# EAGLE design DAPule-STM32F103-v1.0.0 (EAGLE 7.7.0)

## Sheet 1 of 2
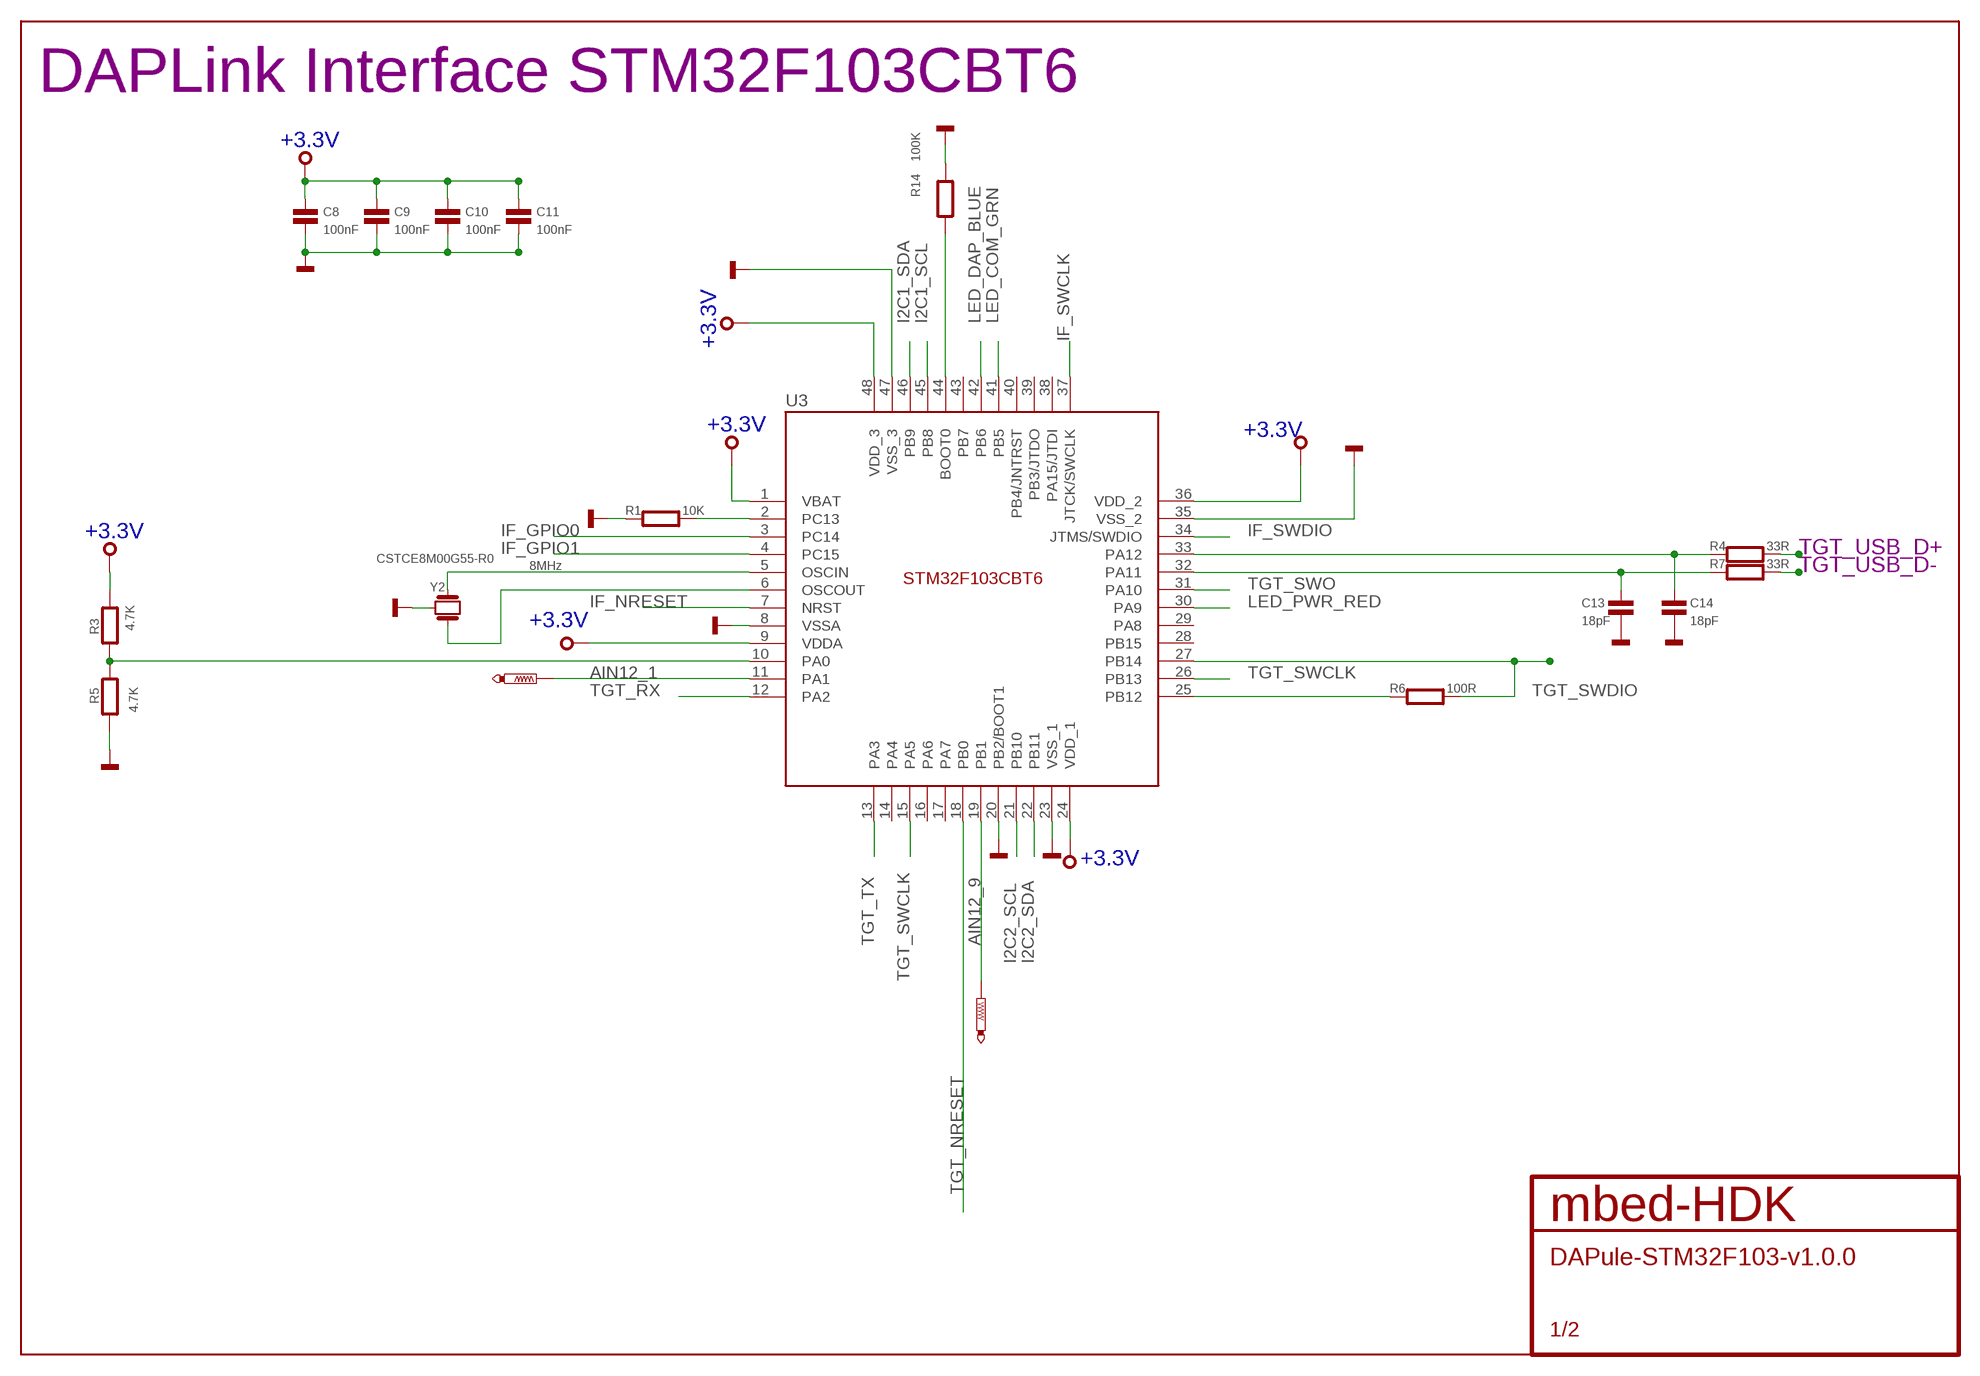
[diagram p0: schematic, sheet 1]

### Parts
C8  100nF  CAPACITOR0603  [0603]
C9  100nF  CAPACITOR0603  [0603]
C10  100nF  CAPACITOR0603  [0603]
C11  100nF  CAPACITOR0603  [0603]
C13  18pF  CAPACITOR0603  [0603]
C14  18pF  CAPACITOR0603  [0603]
R1  10K  RESISTOR0603  [0603]
R3  4.7K  RESISTOR0603  [0603]
R4  33R  RESISTOR0603  [0603]
R5  4.7K  RESISTOR0603  [0603]
R6  100R  RESISTOR0603  [0603]
R7  33R  RESISTOR0603  [0603]
R14  100K  RESISTOR0603  [0603]
TP1  PTR1TP07R  [TP07R]
TP2  PTR1TP07R  [TP07R]
U3  STM32F103CBT6  [LQFP48]
Y2  CSTCE8M00G55-R0  [CSTCE8M00G55-R0]

### Nets
+3.3V: C8.1 C9.1 C10.1 C11.1 R3.1 U3.1(VBAT) U3.9(VDDA) U3.24(VDD_1) U3.36(VDD_2) U3.48(VDD_3) ; also sheet 2
AIN12_1: TP2.TP U3.11(PA1)
AIN12_9: TP1.TP U3.19(PB1)
GND: C8.2 C9.2 C10.2 C11.2 C13.2 C14.2 R1.1 R5.2 R14.1 U3.8(VSSA) U3.20(PB2/BOOT1) U3.23(VSS_1) U3.35(VSS_2) U3.47(VSS_3) Y2.2 ; also sheet 2
I2C1_SCL: U3.45(PB8)
I2C1_SDA: U3.46(PB9)
I2C2_SCL: U3.21(PB10) ; also sheet 2
I2C2_SDA: U3.22(PB11) ; also sheet 2
IF_GPIO0: U3.3(PC14) ; also sheet 2
IF_GPIO1: U3.4(PC15) ; also sheet 2
IF_NRESET: U3.7(NRST) ; also sheet 2
IF_SWCLK: U3.37(JTCK/SWCLK) ; also sheet 2
IF_SWDIO: U3.34(JTMS/SWDIO) ; also sheet 2
LED_COM_GRN: U3.41(PB5) ; also sheet 2
LED_DAP_BLUE: U3.42(PB6) ; also sheet 2
LED_PWR_RED: U3.30(PA9) ; also sheet 2
N$3: R14.2 U3.44(BOOT0)
N$4: R1.2 U3.2(PC13)
N$5: U3.6(OSCOUT) Y2.3
N$6: U3.5(OSCIN) Y2.1
N$8: R3.2 R5.1 U3.10(PA0)
N$12: R6.1 U3.25(PB12)
N$15: C14.1 R4.1 U3.33(PA12)
N$17: C13.1 R7.1 U3.32(PA11)
TGT_NRESET: U3.18(PB0) ; also sheet 2
TGT_RX: U3.12(PA2) ; also sheet 2
TGT_SWCLK: U3.15(PA5) U3.26(PB13) ; also sheet 2
TGT_SWDIO: R6.2 U3.27(PB14) ; also sheet 2
TGT_SWO: U3.31(PA10) ; also sheet 2
TGT_TX: U3.13(PA3) ; also sheet 2
TGT_USB_D+: R4.2 ; also sheet 2
TGT_USB_D-: R7.2 ; also sheet 2
Unconnected: U3.14(PA4) U3.16(PA6) U3.17(PA7) U3.28(PB15) U3.29(PA8) U3.38(PA15/JTDI) U3.39(PB3/JTDO) U3.40(PB4/JNTRST) U3.43(PB7)

### Notes on the sheet
- DAPLink Interface STM32F103CBT6
- 8MHz

## Sheet 2 of 2
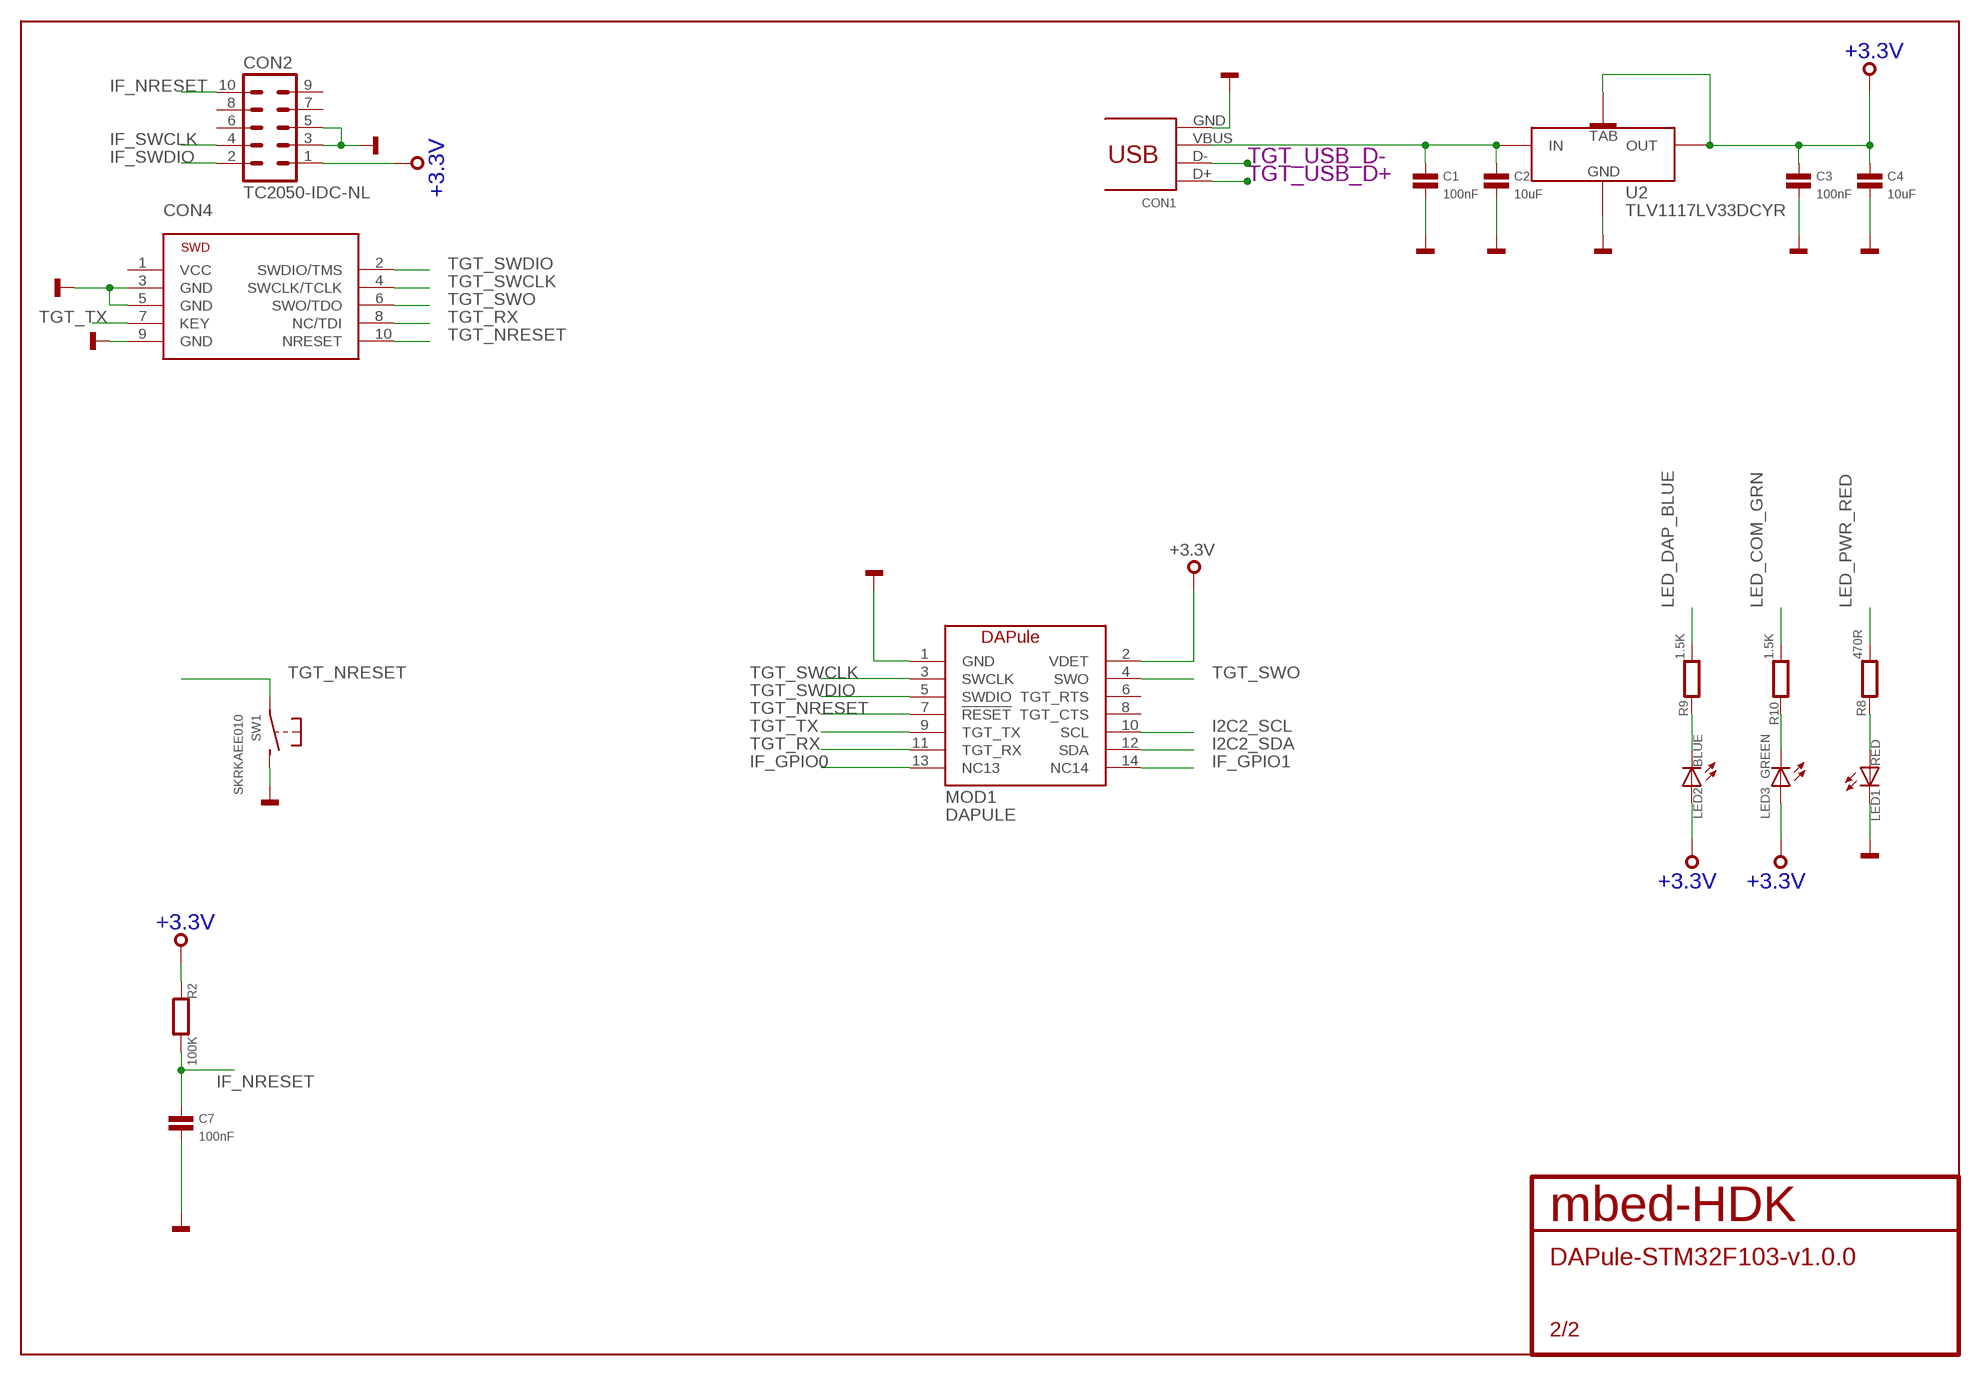
[diagram p1: schematic, sheet 2]

### Parts
C1  100nF  CAPACITOR0603  [0603]
C2  10uF  CAPACITOR0603  [0603]
C3  100nF  CAPACITOR0603  [0603]
C4  10uF  CAPACITOR0603  [0603]
C7  100nF  CAPACITOR0603  [0603]
CON1  47346-0001  [USB-MICRO-B-H]
CON2  TC2050-IDC-NL  [TC2050-IDC-NL]
CON4  SWD-10-SMD  [SWD-10-SMD]
LED1  RED  SMD_LED0603  [CHIPLED_0603]
LED2  BLUE  SMD_LED0603  [CHIPLED_0603]
LED3  GREEN  SMD_LED0603  [CHIPLED_0603]
MOD1  DAPULE  [DAPULE]
R2  100K  RESISTOR0603  [0603]
R8  470R  RESISTOR0603  [0603]
R9  1.5K  RESISTOR0603  [0603]
R10  1.5K  RESISTOR0603  [0603]
SW1  SKRKAEE010  [SKRKAEE010]
U2  TLV1117LV33DCYR  [SOT223]

### Nets
+3.3V: C3.1 C4.1 CON2.1 LED2.A LED3.A MOD1.2(VDET) R2.1 U2.OUT(1)(OUT) U2.OUT(2)(TAB) ; also sheet 1
GND: C1.2 C2.2 C3.2 C4.2 C7.2 CON1.GND CON2.3 CON2.5 CON4.3(GND) CON4.5(GND) CON4.9(GND) LED1.C MOD1.1(GND) SW1.P$2(S) U2.GND ; also sheet 1
I2C2_SCL: MOD1.10(SCL) ; also sheet 1
I2C2_SDA: MOD1.12(SDA) ; also sheet 1
IF_GPIO0: MOD1.13(NC13) ; also sheet 1
IF_GPIO1: MOD1.14(NC14) ; also sheet 1
IF_NRESET: C7.1 CON2.10 R2.2 ; also sheet 1
IF_SWCLK: CON2.4 ; also sheet 1
IF_SWDIO: CON2.2 ; also sheet 1
LED_COM_GRN: R10.2 ; also sheet 1
LED_DAP_BLUE: R9.2 ; also sheet 1
LED_PWR_RED: R8.2 ; also sheet 1
N$1: C1.1 C2.1 CON1.VBUS U2.IN
N$11: LED1.A R8.1
N$13: LED2.C R9.1
N$14: LED3.C R10.1
TGT_NRESET: CON4.10(NRESET) MOD1.7(!RESET) SW1.P$1(P) ; also sheet 1
TGT_RX: CON4.8(NC/TDI) MOD1.11(TGT_RX) ; also sheet 1
TGT_SWCLK: CON4.4(SWCLK/TCLK) MOD1.3(SWCLK) ; also sheet 1
TGT_SWDIO: CON4.2(SWDIO/TMS) MOD1.5(SWDIO) ; also sheet 1
TGT_SWO: CON4.6(SWO/TDO) MOD1.4(SWO) ; also sheet 1
TGT_TX: CON4.7(KEY) MOD1.9(TGT_TX) ; also sheet 1
TGT_USB_D+: CON1.D+ ; also sheet 1
TGT_USB_D-: CON1.D- ; also sheet 1
Unconnected: CON2.6 CON2.7 CON2.8 CON2.9 CON4.1(VCC) MOD1.6(TGT_RTS) MOD1.8(TGT_CTS)

## Library data of the parts
C1 C3 C7-C11 = mbed-HDK-RLCQ:CAPACITOR: Capacitor
C2 C4 C13 C14 = mbed-HDK-RLC:CAPACITOR: Capacitor
CON1 = mbed-HDK-Connector:47346-0001: USB Receptacle Horizontal Micro Type B; MF: MOLEX; MFN: 47346-0001; OC-MOUSER: 538-47346-0001; OC-NEWARK: 1568026
CON2 = mbed-HDK-Connector:TC2050-IDC: Tag-Connect In Circuit Programming & Debug Cable 10 Pin
CON4 = mbed-HDK-Connector:SWD-10: 2.54mm pitch 10-Pin Cortex Programming Header
LED1-LED3 = mbed-HDK-Optical:SMD_LED: LED SMD, Colour Red; MF: Wurth Electronics Inc; MFN: 150060RS75000; OC-DIGIKEY: 732-4978-1-ND; OC-MOUSER: 710-150060RS75000; OC-NEWARK: 2322071
MOD1 = blackbriar:DAPULE
R1 R4 R6 R7 = mbed-HDK-RLC:RESISTOR: Resistor
R2 R3 R5 R8-R10 R14 = mbed-HDK-RLCQ:RESISTOR: Resistor
SW1 = mbed-HDK-Switch:SKRKAEE010: MOMENTARY SWITCH PUSH VERTICAL (SPST); MF: ALPS; MFN: SKRKAEE010; OC-MOUSER: 688-SKRKAE
TP1 TP2 = blackbriar:PTR1: TEST PIN
U2 = mbed-HDK-Power:TLV1117LV33DCYR: LDO Fixed Regulator 3.3v, 1A; MF: Texas Instruments; MFN: TLV1117LV33DCYR; OC-DIGIKEY: 296-28778-1-ND; OC-MOUSER: 595-TLV1117LV33DCYR; OC-NEWARK: 2323647
U3 = mbed-HDK-MF-ST:STM32F103CBT6: ARM® Cortex®-M3 STM32 F1 Microcontroller IC 32-Bit 72MHz 128KB (128K x 8) FLASH; MF: STMicroelectronics; MFN: STM32F103CBT6; OC-DIGIKEY: 497-6288-ND; OC-MOUSER: 511-STM32F103CBT6; OC-NEWARK: 11N8296
Y2 = mbed-HDK-Oscillator:CSTCE8M00G55-R0: Resonator Cermanic, Murata 8MHz 33pF; MF: Murata; MFN: CSTCE8M00G55-R0; OC-DIGIKEY: 490-1195-1-ND; OC-MOUSER: 81-CSTCE8M00G55-R0; OC-NEWARK: 2443270

## Board
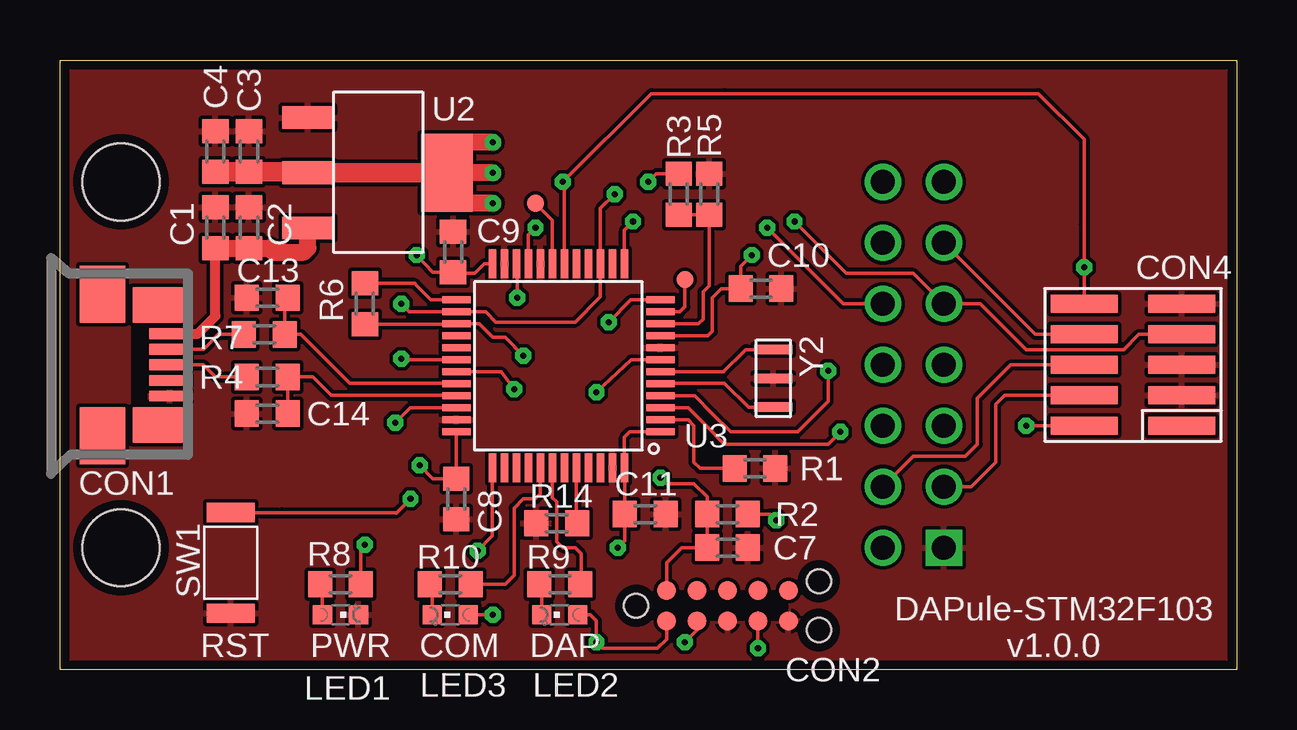
[diagram p2: board, top side]
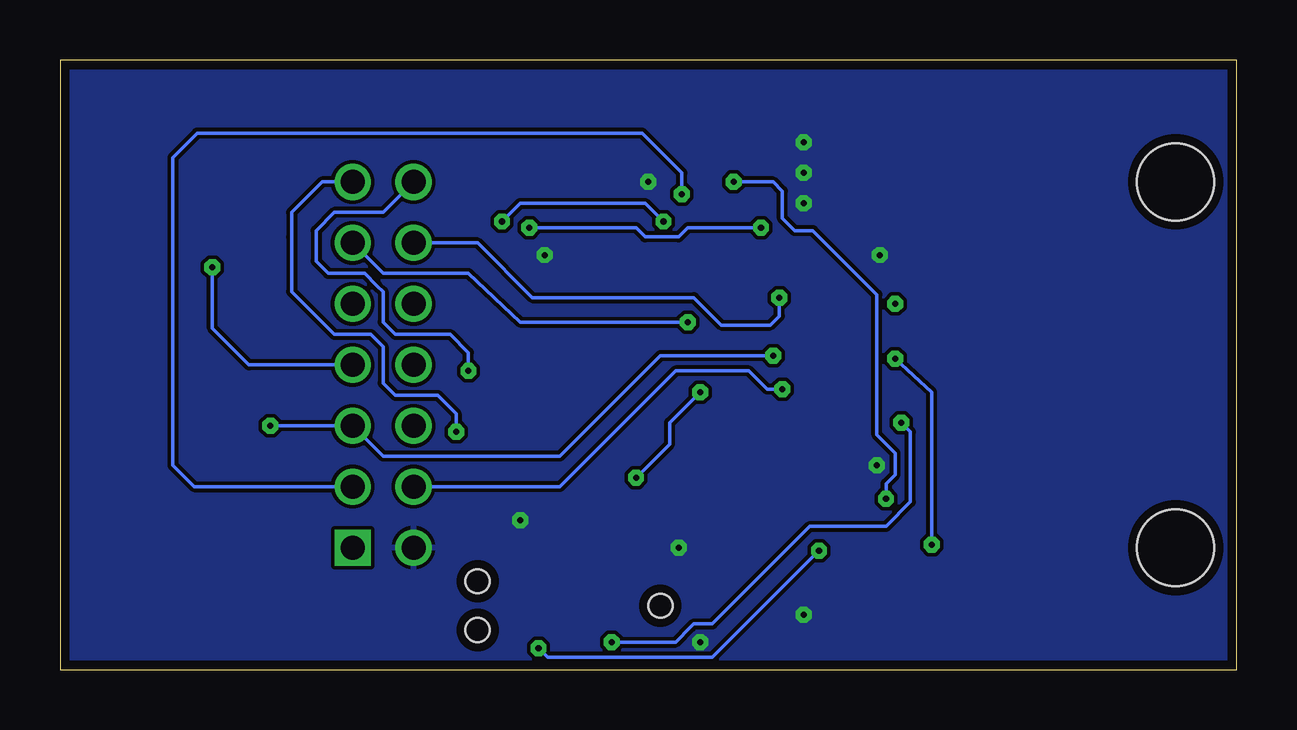
[diagram p3: board, bottom side, seen from below]

Size 49.02 x 25.4 mm. Coordinates in mm from the lower left corner, seen from the top.
Outline: 0,7.62 0,21.59 0,25.4 45.72,25.4 49.02,25.4 49.02,0 45.72,0 0,0 0,3.81 0,7.62
Copper layers ((1*16)): Top 0.035mm / dielectric 0.8mm / Bottom 0.035mm
Design rules "mbed-HDK-6-6-2-layer *": minimum track width 6mil, minimum drill 9mil, track to track 6mil, track to pad 6mil, pad to pad 6mil, via to via 6mil, smd to smd 6mil, copper to edge 15mil, drill to drill 8mil, minimum pad ring 10mil, minimum via ring 8mil, stop-mask expansion 4mil, vias tented up to drill 0mil, thermal gap 6mil

### Footprints (pad centres in the part's own frame; a part is rotated, then mirrored left to right if it is on the bottom)
0603 = smd 1 x 1.1: 1 -0.85,0; 2 0.85,0
USB-MICRO-B-H = smd 1.7 x 0.45: 4 2.8,-0.65; D+ 2.8,0; D- 2.8,0.65; GND 2.8,-1.3; VBUS 2.8,1.3 | smd 1.9 x 2.375: GND1 0,2.95; GND4 0,-2.95 | smd 2.1 x 1.475: GND2 2.3,2.5; GND3 2.3,-2.5
TC2050-IDC-NL = smd 0.787 x 0.787: 1 -2.54,-0.635; 2 -1.27,-0.635; 3 0,-0.635; 4 1.27,-0.635; 5 2.54,-0.635; 6 2.54,0.635; 7 1.27,0.635; 8 0,0.635; 9 -1.27,0.635; 10 -2.54,0.635 | hole 0.991: -3.81,0; 3.81,1.016; 3.81,-1.016
SWD-10-SMD = smd 0.762 x 2.794: 1 0.381,-2.032; 2 0.381,2.032; 3 1.651,-2.032; 4 1.651,2.032; 5 2.921,-2.032; 6 2.921,2.032; 7 4.191,-2.032; 8 4.191,2.032; 9 5.461,-2.032; 10 5.461,2.032
CHIPLED_0603 = smd 0.8 x 0.8: A 0,-0.75; C 0,0.75
DAPULE = drill 1 square: 1 36.83,-7.62 | drill 1: 2 34.29,-7.62; 3 36.83,-5.08; 4 34.29,-5.08; 5 36.83,-2.54; 6 34.29,-2.54; 7 36.83,0; 8 34.29,0; 9 36.83,2.54; 10 34.29,2.54; 11 36.83,5.08; 12 34.29,5.08; 13 36.83,7.62; 14 34.29,7.62 | hole 3.2: 2.54,7.62; 2.54,-7.62
SKRKAEE010 = smd 0.8 x 2: P$1 -2.1,0; P$2 2.1,0
TP07R = smd 0.7 x 0.7: TP 0,0
SOT223 = smd 0.95 x 2.15: GND -2.3,-5.8; IN 2.3,-5.8; OUT(1) 0,-5.8 | smd 3.25 x 2.15: OUT(2) 0,0
LQFP48 = smd 0.3 x 1.2: 1 0,0; 2 0.5,0; 3 1,0; 4 1.5,0; 5 2,0; 6 2.5,0; 7 3,0; 8 3.5,0; 9 4,0; 10 4.5,0; 11 5,0; 12 5.5,0; 25 5.5,8.5; 26 5,8.5; 27 4.5,8.5; 28 4,8.5; 29 3.5,8.5; 30 3,8.5; 31 2.5,8.5; 32 2,8.5; 33 1.5,8.5; 34 1,8.5; 35 0.5,8.5; 36 0,8.5 | smd 1.2 x 0.3: 13 7,1.5; 14 7,2; 15 7,2.5; 16 7,3; 17 7,3.5; 18 7,4; 19 7,4.5; 20 7,5; 21 7,5.5; 22 7,6; 23 7,6.5; 24 7,7; 37 -1.5,7; 38 -1.5,6.5; 39 -1.5,6; 40 -1.5,5.5; 41 -1.5,5; 42 -1.5,4.5; 43 -1.5,4; 44 -1.5,3.5; 45 -1.5,3; 46 -1.5,2.5; 47 -1.5,2; 48 -1.5,1.5
CSTCE8M00G55-R0 = smd 0.4 x 1.6: 1 2.4,0; 2 1.2,0; 3 0,0

### Placement (x,y rotation side)
C1  6.48,18.41 90 top
C2  7.87,18.41 90 top
C3  7.87,21.59 90 top
C4  6.48,21.59 90 top
C7  27.81,5.08 0 top
C8  16.51,7.11 270 top
C9  16.38,17.4 90 top
C10  29.21,15.88 0 top
C11  24.38,6.48 0 top
C13  8.64,15.49 180 top
C14  8.64,10.67 180 top
CON1  1.78,12.7 0 top
CON2  27.81,2.67 0 top
CON4  44.7,9.78 90 top
LED1  11.68,2.29 270 top
LED2  20.83,2.29 90 top
LED3  16.26,2.29 90 top
MOD1  0,12.7 0 top
R1  28.96,8.38 180 top
R2  27.81,6.48 180 top
R3  25.78,19.81 270 top
R4  8.64,12.19 180 top
R5  27.05,19.81 90 top
R6  12.7,15.24 270 top
R7  8.51,13.97 180 top
R8  11.68,3.56 0 top
R9  20.83,3.56 0 top
R10  16.26,3.56 0 top
R14  20.7,6.1 0 top
SW1  7.11,4.44 270 top
TP1  19.81,19.43 0 top
TP2  26.04,16.26 0 top
U2  16.13,20.7 270 top
U3  25.02,9.91 90 top
Y2  29.72,13.33 270 top

### Tracks (layer width: path | path; a pad name or v marks a point on that pad's centre or on a via)
+3.3V  (via drill 0.25)
  Top 0.152: LED3.A v18.03,2.29 | LED2.A 22.1,2.29 22.35,2.03 v22.35,1.14 22.61,0.89 24.89,0.89 25.27,1.27 CON2.1 | R2.1 29.59,6.48 v29.84,6.22 | U3.24 17.67,16.91 17.27,16.51 16.42,16.51 C9.1 15.53,16.55 v14.86,17.27 | R3.1 24.85,20.66 v24.51,20.32 | U3.36 C8.1 15.53,7.96 v14.99,8.51 | U3.1 23.75,9.91 23.52,9.68 U3.48 23.53,8.39 C11.1 23.53,5.37 v23.24,5.08 | U3.9 26.99,13.91 27.18,14.1 27.18,15.49 27.56,15.88 C10.1 28.36,16.8 v28.83,17.27
  Top 0.711: v18.03,20.7 U2.OUT(2) | v18.03,21.97 16.13,21.97 U2.OUT(2) | v18.03,19.43 16.13,19.43 U2.OUT(2)
  Top 0.813: C4.1 C3.1 10.29,20.74 U2.OUT(1) U2.OUT(2)
  pour Bottom: 0,0 49.02,0 49.02,25.4 0,25.4
AIN12_1
  Top 0.152: U3.11 25.83,14.91 26.04,15.11 TP2.TP
AIN12_9
  Top 0.152: U3.19 20.52,18.72 TP1.TP
GND
  pour Top: 0,0 49.02,0 49.02,25.4 0,25.4
I2C2_SCL  (via drill 0.25)
  Top 0.152: U3.21 19.52,18.12 v19.81,18.41 | MOD1.10 32.64,15.24 31.75,16.13 30.61,17.27 v29.46,18.41
  Bottom 0.152: v19.81,18.41 22.86,18.41 23.24,18.03 24.64,18.03 25.02,18.41 v29.46,18.41
I2C2_SDA  (via drill 0.25)
  Top 0.152: v19.05,15.49 19.05,16.88 U3.22
  Bottom 0.152: MOD1.12 31.62,17.78 29.34,15.49 22.61,15.49 21.46,14.35 19.43,14.35 19.05,14.73 v19.05,15.49
IF_GPIO0  (via drill 0.25)
  Top 0.152: U3.3 26.18,10.91 26.92,10.16 27.69,9.4 32,9.4 v32.51,9.91
  Bottom 0.152: MOD1.13 38.1,20.32 39.37,19.05 39.37,18.03 39.37,15.75 37.59,13.97 36.07,13.97 35.56,13.46 35.56,11.94 35.05,11.43 33.27,11.43 32.51,10.67 v32.51,9.91
IF_GPIO1  (via drill 0.25)
  Top 0.152: U3.4 26.44,11.41 27.18,10.67 27.94,9.91 30.23,9.91 30.73,9.91 32,11.18 v32,12.45
  Bottom 0.152: MOD1.14 35.56,19.05 37.59,19.05 38.35,18.29 38.35,17.02 37.85,16.51 36.32,16.51 35.81,16 35.56,15.75 35.56,14.48 35.05,13.97 32.77,13.97 32,13.21 v32,12.45
IF_NRESET  (via drill 0.25)
  Top 0.152: CON2.10 25.27,4.44 25.91,5.08 C7.1 R2.2 26.96,7.2 26.42,7.75 25.27,7.75 v25.02,8 | v22.35,11.56 23.8,12.91 U3.7
  Bottom 0.152: v25.02,8 23.62,9.4 23.62,10.29 v22.35,11.56
IF_SWCLK  (via drill 0.25)
  Top 0.152: U3.37 18.02,5.57 v17.4,4.95 | v29.08,0.89 CON2.4
  Bottom 0.152: v29.08,0.89 28.7,0.51 21.84,0.51 v17.4,4.95
IF_SWDIO  (via drill 0.25)
  Top 0.152: CON2.2 26.54,1.65 v26.04,1.14 | v13.97,10.29 14.59,10.91 U3.34
  Bottom 0.152: v26.04,1.14 23.37,1.14 22.73,1.78 22.61,1.9 21.84,1.9 21.34,2.41 17.78,5.97 14.61,5.97 13.59,6.98 13.59,9.91 v13.97,10.29
LED_COM_GRN
  Top 0.152: U3.41 20.02,7.32 19.81,7.11 19.3,7.11 18.92,6.73 18.92,3.94 18.54,3.56 R10.2
LED_DAP_BLUE
  Top 0.152: U3.42 20.52,7.17 20.7,6.98 20.7,5.33 20.95,5.08 21.46,5.08 21.72,4.83 21.72,3.59 R9.2
LED_PWR_RED  (via drill 0.25)
  Top 0.152: R8.2 12.53,5.04 v12.7,5.21 | v14.22,12.95 14.27,12.91 U3.30
  Bottom 0.152: v12.7,5.21 12.7,11.56 v14.22,12.95
N$1
  Top 0.406: CON1.VBUS 5.75,14 6.48,14.73 C1.1
  Top 0.711: C1.1 C2.1 8.72,17.56 8.89,17.4 10.16,17.4 10.29,17.53 10.33,17.57 U2.IN
N$3
  Top 0.152: R14.2 21.52,6.13 U3.44
N$4
  Top 0.152: U3.2 26.17,10.41 26.42,10.16 26.42,8.64 26.67,8.38 R1.2
N$5
  Top 0.152: U3.6 26.5,12.41 27.65,12.41 27.69,12.45 28.45,13.21 28.57,13.33 Y2.3
N$6
  Top 0.152: U3.5 25.24,11.91 25.27,11.94 26.54,11.94 27.69,11.94 28.7,10.92 29.7,10.92 Y2.1
N$8
  Top 0.152: U3.10 26.6,14.41 26.8,14.6 26.8,15.75 27.05,16 R5.1 R3.2
N$11
  Top 0.152: R8.1 10.93,3.46 LED1.A
N$12
  Top 0.152: U3.25 15.46,15.41 14.86,16 14.77,16.09 R6.1
N$13
  Top 0.152: R9.1 20.08,3.46 LED2.C
N$14
  Top 0.152: R10.1 15.51,3.46 LED3.C
N$15
  Top 0.152: C14.1 R4.1 10.54,12.19 11.3,11.43 16.5,11.43 U3.33
N$17
  Top 0.152: U3.32 16.49,11.94 12.06,11.94 10.03,13.97 R7.1 9.36,15.37 C13.1
TGT_NRESET  (via drill 0.25)
  Top 0.152: v14.61,7.11 14.01,6.52 13.98,6.54 9.24,6.54 SW1.P$1 | U3.18 21.02,20.26 v20.95,20.32 24.64,24 27.69,24 40.77,24 42.67,22.1 42.67,18.54 v42.67,16.76 CON4.10
  Bottom 0.152: v14.61,7.11 14.61,7.75 14.22,8.13 14.22,9.02 14.99,9.78 14.99,15.62 17.65,18.29 18.41,18.29 18.92,18.8 18.92,19.94 19.3,20.32 v20.95,20.32 | MOD1.7 41.15,12.7 42.67,14.22 v42.67,16.76
TGT_RX  (via drill 0.25)
  Top 0.152: U3.12 23.79,15.41 v22.86,14.48 | MOD1.11 40.64,13.97 CON4.8
  Bottom 0.152: MOD1.11 35.56,16.51 33.91,16.51 32,16.51 29.84,14.48 v22.86,14.48
TGT_SWCLK  (via drill 0.25)
  Top 0.152: v14.22,15.24 14.56,14.91 U3.26 17.73,14.91 18.16,14.48 21.46,14.48 22.48,15.49 22.52,15.53 U3.15 22.52,19.22 v23.11,19.81 | MOD1.3 37.97,7.62 38.99,8.64 38.99,11.05 39.37,11.43 41.91,11.43 CON4.4
  Bottom 0.152: v23.11,19.81 23.11,20.7 24.77,22.35 27.05,22.35 43.31,22.35 44.32,21.34 44.32,8.51 43.43,7.62 MOD1.3
TGT_SWDIO  (via drill 0.25)
  Top 0.152: R6.2 16.5,14.39 U3.27 17.47,14.41 18.03,13.84 18.54,13.84 v19.3,13.08 | v40.26,10.16 CON4.2
  Bottom 0.152: v19.3,13.08 24,13.08 28.19,8.89 35.56,8.89 MOD1.5 v40.26,10.16
TGT_SWO  (via drill 0.25)
  Top 0.152: U3.31 18.38,12.41 v18.92,11.68 | MOD1.4 35.56,8.89 37.72,8.89 38.23,9.4 38.23,11.3 39.62,12.7 42.16,12.7 CON4.6
  Bottom 0.152: v18.92,11.68 19.56,11.68 20.32,12.45 23.37,12.45 28.19,7.62 MOD1.4
TGT_TX  (via drill 0.25)
  Top 0.152: U3.13 23.52,18.31 v23.88,18.67 | v30.61,18.67 32.77,16.51 35.56,16.51 MOD1.9 38.35,15.24 40.26,13.33 44.32,13.33 44.96,13.97 CON4.7
  Bottom 0.152: v30.61,18.67 29.84,19.43 24.64,19.43 v23.88,18.67
TGT_USB_D+
  Top 0.152: CON1.D+ 5.97,12.7 6.48,12.19 R4.2
TGT_USB_D-
  Top 0.152: CON1.D- 5.98,13.35 6.6,13.97 R7.2

### Text on the board
tPlace: DAPule-STM32F103 / v1.0.0 | RST | PWR | COM | DAP